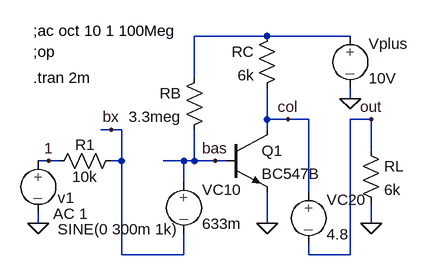
[diagram p0: schematic q1-verst-aussteuer-c12-uquellen.asc]
q1-verst-aussteuer-c12-uquellen.asc, the LTspice schematic file:
Version 4
SHEET 1 880 680
WIRE 176 -16 64 -16
WIRE 304 -16 176 -16
WIRE 64 48 64 -16
WIRE 304 80 304 64
WIRE 176 112 176 64
WIRE 208 112 176 112
WIRE 240 112 208 112
WIRE 336 112 304 112
WIRE -64 128 -80 128
WIRE -48 128 -64 128
WIRE 176 128 176 112
WIRE 336 160 336 112
WIRE -160 176 -176 176
WIRE -144 176 -160 176
WIRE -48 176 -48 128
WIRE -48 176 -64 176
WIRE 48 176 16 176
WIRE 64 176 64 128
WIRE 64 176 48 176
WIRE 96 176 64 176
WIRE 112 176 96 176
WIRE 48 208 48 176
WIRE 240 224 240 112
WIRE -176 272 -176 256
WIRE 176 272 176 224
WIRE 336 272 336 240
WIRE -48 320 -48 176
WIRE 48 320 48 288
WIRE 48 320 -48 320
WIRE 240 320 240 304
WIRE 304 320 304 112
WIRE 304 320 240 320
FLAG 176 272 0
FLAG 304 80 0
FLAG 96 176 bas
FLAG 208 112 col
FLAG -176 272 0
FLAG -160 176 1
FLAG 336 272 0
FLAG 336 112 out
FLAG -64 128 bx
SYMBOL EIT_Semiconductors\\npn 112 128 R0
SYMATTR InstName Q1
SYMATTR Value BC547B
SYMBOL source-V 304 -32 R0
SYMATTR InstName Vplus
SYMATTR Value 10V
SYMBOL source-V -176 160 R0
WINDOW 123 23 97 Left 2
WINDOW 39 0 0 Left 2
WINDOW 0 30 73 Left 2
WINDOW 3 30 121 Left 2
SYMATTR Value2 AC 1
SYMATTR InstName v1
SYMATTR Value SINE(0 300m 1k)
SYMBOL res 192 -32 M0
SYMATTR InstName RC
SYMATTR Value 6k
SYMBOL res 80 32 M0
SYMATTR InstName RB
SYMATTR Value 3.3meg
SYMBOL res -160 192 R270
WINDOW 0 25 56 VTop 2
WINDOW 3 7 56 VBottom 2
SYMATTR InstName R1
SYMATTR Value 10k
SYMBOL res 320 144 R0
SYMATTR InstName RL
SYMATTR Value 6k
SYMBOL source-V 240 208 R0
WINDOW 123 0 0 Left 2
WINDOW 39 0 0 Left 2
SYMATTR InstName VC20
SYMATTR Value 4.8
SYMBOL source-V 48 192 R0
WINDOW 123 0 0 Left 2
WINDOW 39 0 0 Left 2
SYMATTR InstName VC10
SYMATTR Value 633m
TEXT -184 8 Left 2 !;op
TEXT -184 48 Left 2 !.tran 2m
TEXT -184 -24 Left 2 !;ac oct 10 1 100Meg

The netlist it stands for:
* q1-verst-aussteuer-c12-uquellen.asc
Q1 col bas 0 0 BC547B
Vplus N001 0 10V
v1 1 0 SINE(0 300m 1k) AC 1
RC N001 col 6k
RB N001 bas 3.3meg
R1 1 bx 10k
RL out 0 6k
VC20 col out 4.8
VC10 bas bx 633m
.model NPN NPN
.model PNP PNP
.lib standard.bjt
;op
.tran 2m
;ac oct 10 1 100Meg
.backanno
.end